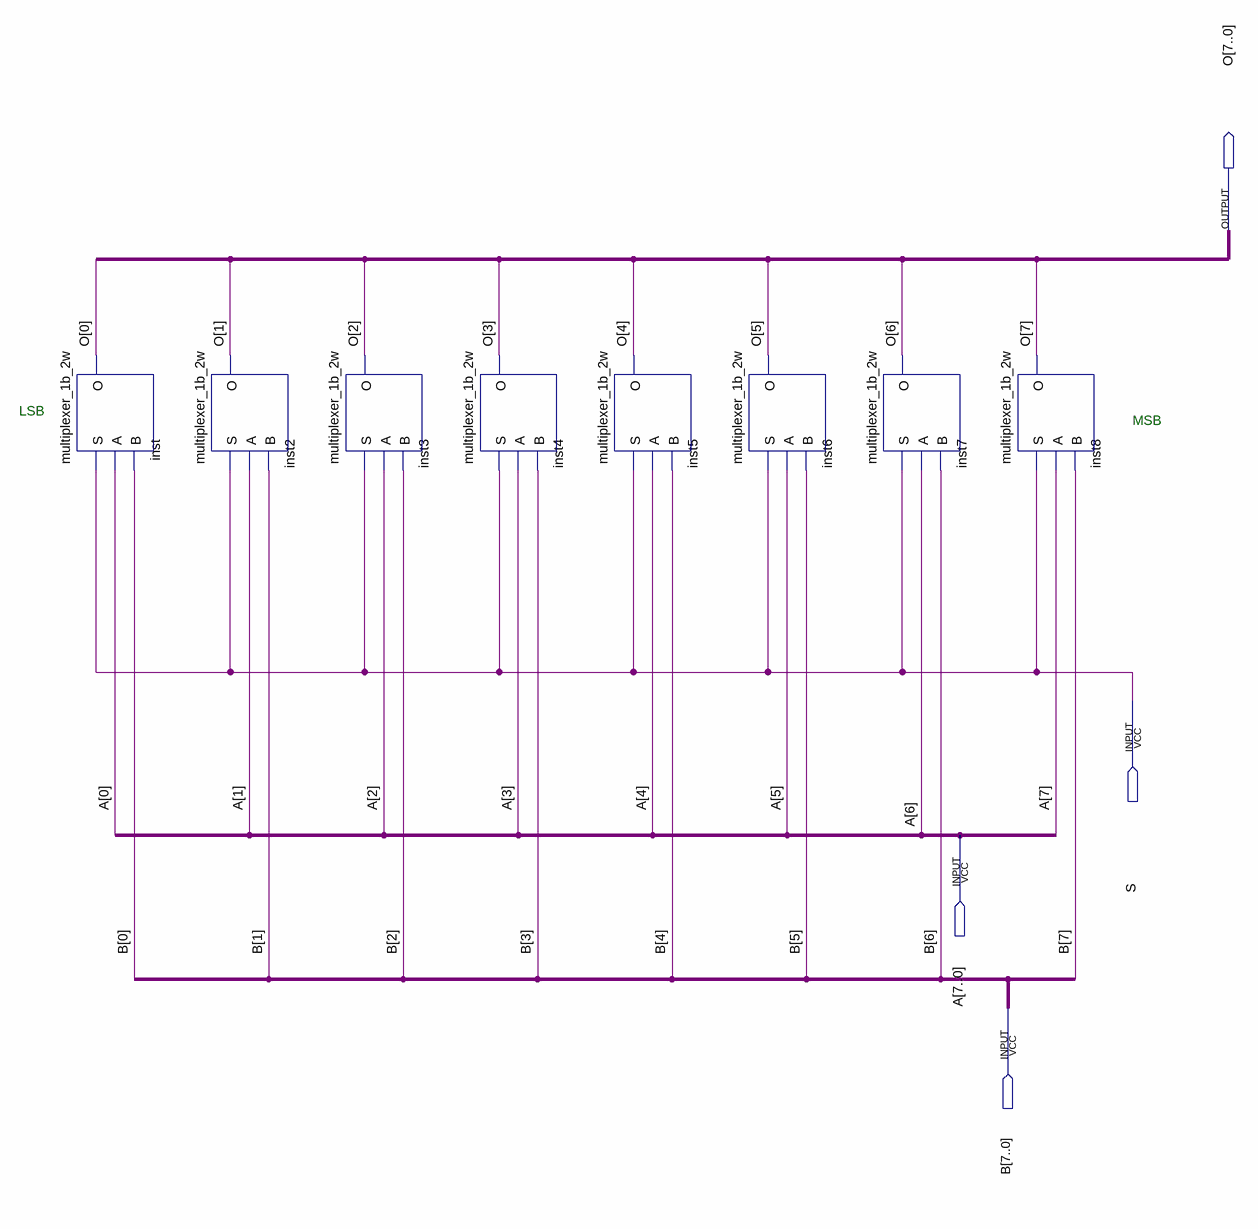
[diagram p0: schematic sheet]
// Quartus schematic multiplexer_8b_2w.bdf as structural Verilog: 8 symbols, 4 pins
module multiplexer_8b_2w (
  input  S,
  input  [7:0] A,
  input  [7:0] B,
  output [7:0] O
);

  multiplexer_1b_2w inst (.S(S), .A(A[0]), .B(B[0]), .O(O[0]));
  multiplexer_1b_2w inst2 (.S(S), .A(A[1]), .B(B[1]), .O(O[1]));
  multiplexer_1b_2w inst3 (.S(S), .A(A[2]), .B(B[2]), .O(O[2]));
  multiplexer_1b_2w inst4 (.S(S), .A(A[3]), .B(B[3]), .O(O[3]));
  multiplexer_1b_2w inst5 (.S(S), .A(A[4]), .B(B[4]), .O(O[4]));
  multiplexer_1b_2w inst6 (.S(S), .A(A[5]), .B(B[5]), .O(O[5]));
  multiplexer_1b_2w inst7 (.S(S), .A(A[6]), .B(B[6]), .O(O[6]));
  multiplexer_1b_2w inst8 (.S(S), .A(A[7]), .B(B[7]), .O(O[7]));

  // Notes on the sheet:
  //   LSB
  //   MSB
endmodule
